# EAGLE schematic hes_keypad (EAGLE 8.2.2)
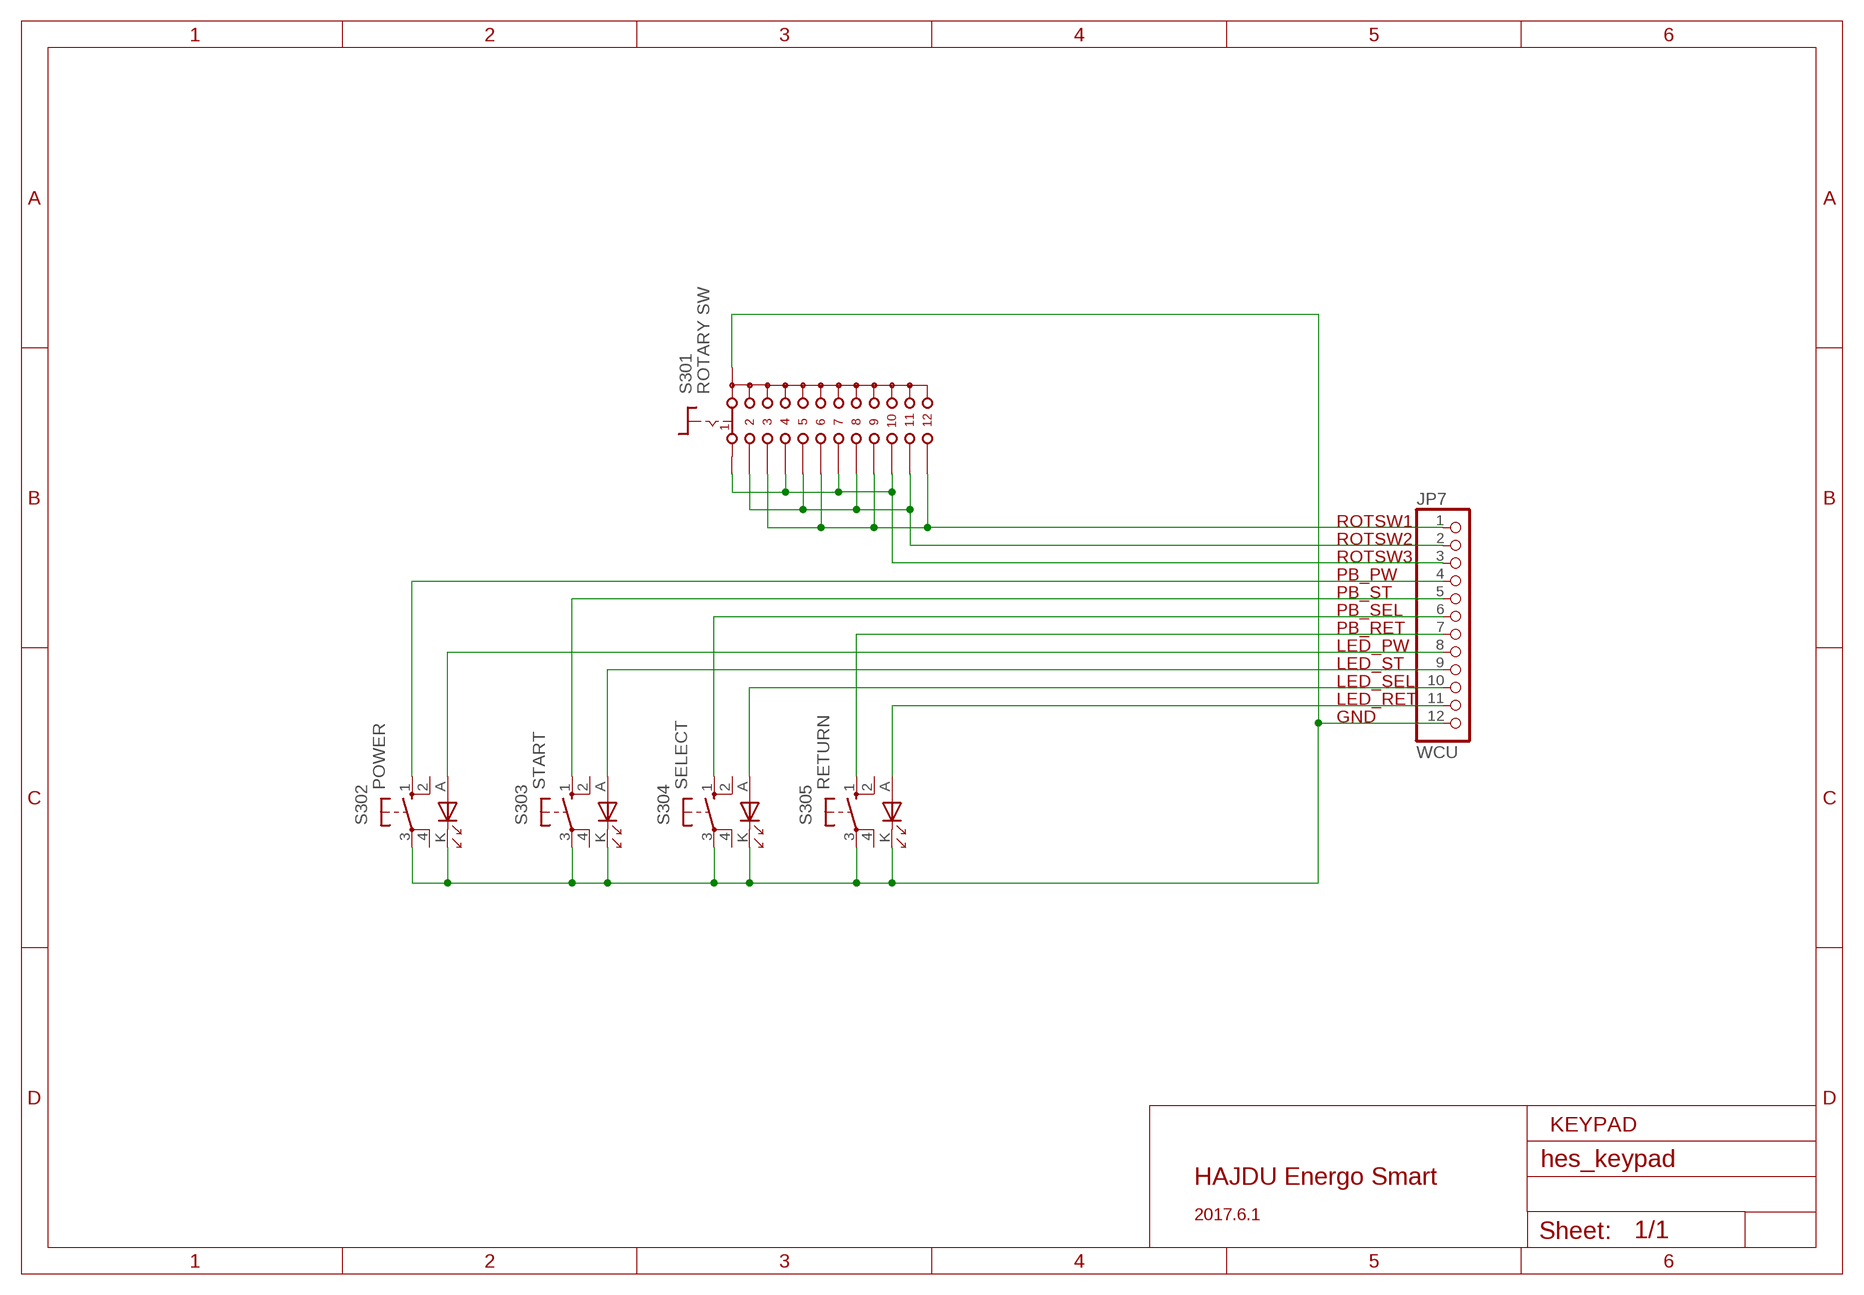
[diagram p0: schematic, sheet 1]

## Parts
JP7  WCU  PINHD-1X12  [1X12]
S301  ROTARY SW  ELMA-01-1X12  [ELMA-01-1X12]
S302  POWER  40/L3  [B3F/40L3]
S303  START  40/L3  [B3F/40L3]
S304  SELECT  40/L3  [B3F/40L3]
S305  RETURN  40/L3  [B3F/40L3]

## Nets
N$5: JP7.12 S301.A S302.3(P) S302.K(C) S303.3(P) S303.K(C) S304.3(P) S304.K(C) S305.3(P) S305.K(C)
N$6: JP7.3 S301.1 S301.4 S301.7 S301.10
N$7: JP7.11 S305.A
N$8: JP7.10
N$9: JP7.9
N$10: JP7.8
N$11: JP7.7 S305.1(S)
N$12: JP7.6 S304.1(S)
N$13: JP7.5 S303.1(S)
N$14: JP7.4 S302.1(S)
N$15: JP7.2 S301.2 S301.5 S301.8 S301.11
N$16: JP7.1 S301.3 S301.6 S301.9 S301.12
Unconnected: S302.2(S1) S302.4(P1) S302.A S303.2(S1) S303.4(P1) S303.A S304.2(S1) S304.4(P1) S304.A S305.2(S1) S305.4(P1)

## Notes on the sheet
- ROTSW1
- ROTSW2
- ROTSW3
- PB_PW
- PB_ST
- PB_SEL
- PB_RET
- LED_PW
- LED_ST
- LED_SEL
- LED_RET
- GND
- KEYPAD
- HAJDU Energo Smart
- 2017.6.1

## Library data of the parts
JP7 = pinhead:PINHD-1X12: PIN HEADER
S301 = switch:ELMA-01-1X12: Rotary Switches Type 01 Source: http://www.elma.com/files/products/rotary_components/pdfs/rotary_switches_type_01_002.pdf
S302-S305 = switch-omron:40/L3: OMRON SWITCH; OC_FARNELL: unknown; OC_NEWARK: unknown